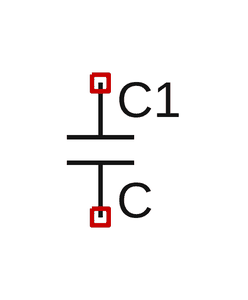
[diagram p0: schematic Draft1.asc]
Draft1.asc, the LTspice schematic file:
Version 4
SHEET 1 880 680
SYMBOL cap 128 64 R0
SYMATTR InstName C1

The netlist it stands for:
* Draft1.asc
C1 NC_01 NC_02 C
.backanno
.end